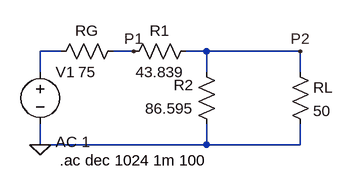
[diagram p0: schematic Draft3.asc]
Draft3.asc, the LTspice schematic file:
Version 4
SHEET 1 880 680
WIRE -32 80 -64 80
WIRE 80 80 48 80
WIRE 192 80 160 80
WIRE 336 80 192 80
WIRE -64 112 -64 80
WIRE 192 112 192 80
WIRE 336 112 336 80
WIRE -64 224 -64 192
WIRE 192 224 192 192
WIRE 192 224 -64 224
WIRE 336 224 336 192
WIRE 336 224 192 224
FLAG -64 224 0
FLAG 336 80 P2
FLAG 80 80 P1
SYMBOL voltage -64 96 R0
WINDOW 123 24 124 Left 2
WINDOW 39 0 0 Left 0
SYMATTR InstName V1
SYMATTR Value ""
SYMATTR Value2 AC 1
SYMBOL res 176 64 R90
WINDOW 0 0 56 VBottom 2
WINDOW 3 32 56 VTop 2
SYMATTR InstName R1
SYMATTR Value 43.839
SYMBOL res 208 208 R180
WINDOW 0 36 76 Left 2
WINDOW 3 36 40 Left 2
SYMATTR InstName R2
SYMATTR Value 86.595
SYMBOL res 320 96 R0
SYMATTR InstName RL
SYMATTR Value 50
SYMBOL res 64 64 R90
WINDOW 0 0 56 VBottom 2
WINDOW 3 32 56 VTop 2
SYMATTR InstName RG
SYMATTR Value 75
TEXT -34 248 Left 2 !.ac dec 1024 1m 100

The netlist it stands for:
* Draft3.asc
V1 N001 0 AC 1
R1 P2 P1 43.839
R2 0 P2 86.595
RL P2 0 50
RG P1 N001 75
.ac dec 1024 1m 100
.backanno
.end